# Altium schematic sheet Dash Area.SchDoc: =DocumentName
size A4; Organization: Queen's Formula SAE; Address1: 130 Stuart St, Kingston; Address2: Ontario; Address3: Canada; Address4: K7L 2V9; DocumentNumber: 1; Revision: 0; SheetNumber: 1; SheetTotal: 1
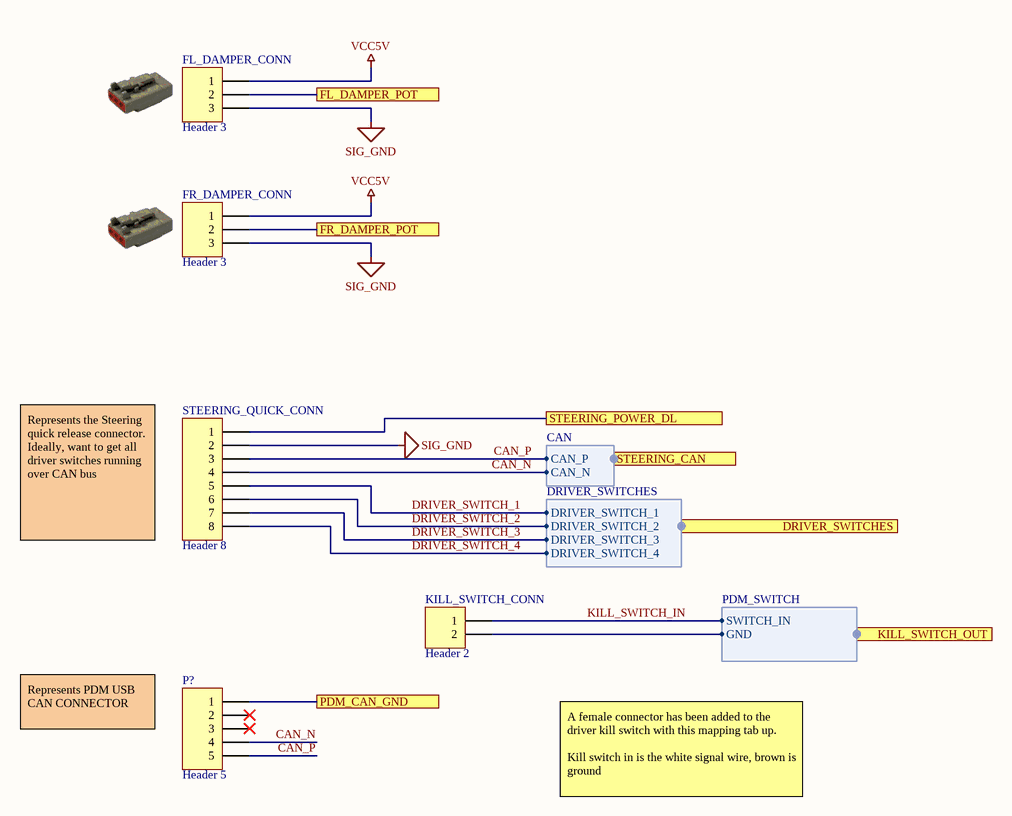
[diagram p0: Dash Area.SchDoc]

## Parts
FL_DAMPER_CONN  Header 3  [HDR1X3]
FR_DAMPER_CONN  Header 3  [HDR1X3]
KILL_SWITCH_CONN  Header 2  [HDR1X2]
P?  Header 5  [HDR1X5]
STEERING_QUICK_CONN  Header 8  [HDR1X8]

## Ports
DRIVER_SWITCHES (harness DRIVER_SWITCHES), FL_DAMPER_POT, FR_DAMPER_POT, KILL_SWITCH_OUT (harness PDM_SWITCH), PDM_CAN_GND, STEERING_CAN (harness CAN), STEERING_POWER_DL

## Harnesses
CAN: CAN_P, CAN_N
DRIVER_SWITCHES: DRIVER_SWITCH_1, DRIVER_SWITCH_2, DRIVER_SWITCH_3, DRIVER_SWITCH_4
PDM_SWITCH: SWITCH_IN, GND

## Nets
SIG_GND: FL_DAMPER_CONN.3 FR_DAMPER_CONN.3 STEERING_QUICK_CONN.2
VCC5V: FL_DAMPER_CONN.1 FR_DAMPER_CONN.1
CAN_N: P?.4 STEERING_QUICK_CONN.4 ; port STEERING_CAN.CAN_N
CAN_P: P?.5 STEERING_QUICK_CONN.3 ; port STEERING_CAN.CAN_P
DRIVER_SWITCH_1: STEERING_QUICK_CONN.5 ; port DRIVER_SWITCHES.DRIVER_SWITCH_1
DRIVER_SWITCH_2: STEERING_QUICK_CONN.6 ; port DRIVER_SWITCHES.DRIVER_SWITCH_2
DRIVER_SWITCH_3: STEERING_QUICK_CONN.7 ; port DRIVER_SWITCHES.DRIVER_SWITCH_3
DRIVER_SWITCH_4: STEERING_QUICK_CONN.8 ; port DRIVER_SWITCHES.DRIVER_SWITCH_4
FL_DAMPER_POT: FL_DAMPER_CONN.2 ; port FL_DAMPER_POT
FR_DAMPER_POT: FR_DAMPER_CONN.2 ; port FR_DAMPER_POT
KILL_SWITCH_IN: KILL_SWITCH_CONN.1 ; port KILL_SWITCH_OUT.SWITCH_IN
PDM_CAN_GND: P?.1 ; port PDM_CAN_GND
STEERING_POWER_DL: STEERING_QUICK_CONN.1 ; port STEERING_POWER_DL
NetKILL_SWITCH_CONN_2: KILL_SWITCH_CONN.2 ; port KILL_SWITCH_OUT.GND

Not connected (* = marked no-connect by the designer): P? 2* 3*

## Notes on the sheet
- Represents the Steering quick release connector. Ideally, want to get all driver switches running over CAN bus
- Represents PDM USB CAN CONNECTOR
- A female connector has been added to the driver kill switch with this mapping tab up.
  Kill switch in is the white signal wire, brown is ground
- Title
- Size:
- Date:
- A4
- Number:
- Time:
- Revision:
- Sheet
- of
- File:

## Library data of the parts
FL_DAMPER_CONN FR_DAMPER_CONN = Header 3: Header, 3-Pin; LatestRevisionDate: 17-Jul-2002; LatestRevisionNote: Re-released for DXP Platform.; Publisher: Altium Limited
KILL_SWITCH_CONN = Header 2: Header, 2-Pin; LatestRevisionDate: 17-Jul-2002; LatestRevisionNote: Re-released for DXP Platform.; Publisher: Altium Limited
P? = Header 5: Header, 5-Pin; LatestRevisionDate: 17-Jul-2002; LatestRevisionNote: Re-released for DXP Platform.; Publisher: Altium Limited
STEERING_QUICK_CONN = Header 8: Header, 8-Pin; LatestRevisionDate: 17-Jul-2002; LatestRevisionNote: Re-released for DXP Platform.; Publisher: Altium Limited